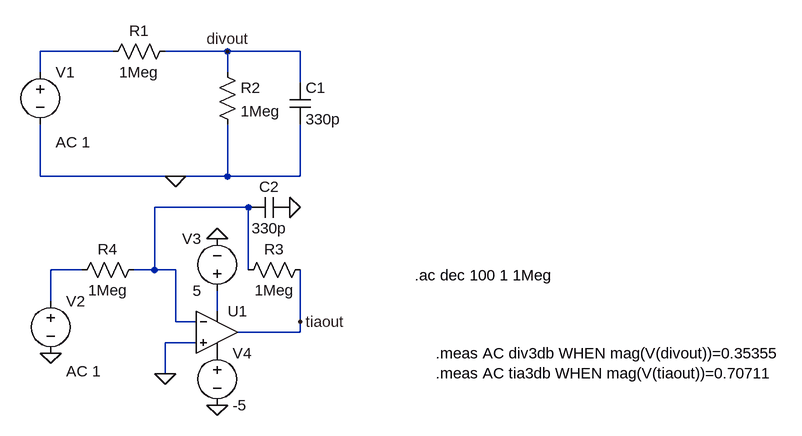
[diagram p0: schematic divider_vs_tia.asc]
divider_vs_tia.asc, the LTspice schematic file:
Version 4.1
SHEET 1 1248 768
WIRE 176 96 64 96
WIRE 352 96 256 96
WIRE 464 96 352 96
WIRE 64 128 64 96
WIRE 352 128 352 96
WIRE 464 144 464 96
WIRE 64 288 64 208
WIRE 272 288 64 288
WIRE 352 288 352 208
WIRE 352 288 272 288
WIRE 464 288 464 208
WIRE 464 288 352 288
WIRE 384 336 240 336
WIRE 128 432 80 432
WIRE 240 432 240 336
WIRE 240 432 208 432
WIRE 272 432 240 432
WIRE 384 432 384 336
WIRE 80 480 80 432
WIRE 336 496 336 464
WIRE 272 512 272 432
WIRE 304 512 272 512
WIRE 464 512 464 432
WIRE 464 528 464 512
WIRE 464 528 368 528
WIRE 304 544 256 544
WIRE 256 592 256 544
FLAG 352 96 divout
FLAG 336 640 0
FLAG 256 592 0
FLAG 336 384 0
FLAG 464 512 tiaout
FLAG 80 560 0
FLAG 272 288 0
FLAG 448 336 0
SYMBOL voltage 64 112 R0
WINDOW 123 24 124 Left 2
WINDOW 39 0 0 Left 0
SYMATTR InstName V1
SYMATTR Value ""
SYMATTR Value2 AC 1
SYMBOL res 272 80 R90
WINDOW 0 0 56 VBottom 2
WINDOW 3 32 56 VTop 2
SYMATTR InstName R1
SYMATTR Value 1Meg
SYMBOL res 336 112 R0
SYMATTR InstName R2
SYMATTR Value 1Meg
SYMBOL cap 448 144 R0
SYMATTR InstName C1
SYMATTR Value 330p
SYMBOL OpAmps\\UniversalOpAmp2 336 528 R0
SYMATTR InstName U1
SYMBOL voltage 80 464 R0
WINDOW 123 24 124 Left 2
WINDOW 39 0 0 Left 0
SYMATTR InstName V2
SYMATTR Value ""
SYMATTR Value2 AC 1
SYMBOL res 480 416 R90
WINDOW 0 0 56 VBottom 2
WINDOW 3 32 56 VTop 2
SYMATTR InstName R3
SYMATTR Value 1Meg
SYMBOL cap 448 320 R90
WINDOW 0 0 32 VBottom 2
WINDOW 3 32 32 VTop 2
SYMATTR InstName C2
SYMATTR Value 330p
SYMBOL voltage 336 480 R180
WINDOW 0 24 96 Left 2
WINDOW 3 24 16 Left 2
WINDOW 123 0 0 Left 0
WINDOW 39 0 0 Left 0
SYMATTR InstName V3
SYMATTR Value 5
SYMBOL voltage 336 544 R0
WINDOW 123 0 0 Left 0
WINDOW 39 0 0 Left 0
SYMATTR InstName V4
SYMATTR Value -5
SYMBOL res 224 416 R90
WINDOW 0 0 56 VBottom 2
WINDOW 3 32 56 VTop 2
SYMATTR InstName R4
SYMATTR Value 1Meg
TEXT 640 440 Left 2 !.ac dec 100 1 1Meg
TEXT 672 560 Left 2 !.meas AC div3db WHEN mag(V(divout))=0.35355\n.meas AC tia3db WHEN mag(V(tiaout))=0.70711

The netlist it stands for:
* divider_vs_tia.asc
V1 N001 0 AC 1
R1 divout N001 1Meg
R2 divout 0 1Meg
C1 divout 0 330p
X§U1 0 N002 N004 P001 tiaout level2 Avol=1Meg GBW=10Meg Slew=10Meg Ilimit=25m Rail=0 Vos=0 En=0 Enk=0 In=0 Ink=0 Rin=500Meg  ; pins In+ In- V+ V- OUT
V2 N003 0 AC 1
R3 tiaout N002 1Meg
C2 0 N002 330p
V3 N004 0 5
V4 P001 0 -5
R4 N002 N003 1Meg
.ac dec 100 1 1Meg
.meas AC div3db WHEN mag(V(divout))=0.35355
.meas AC tia3db WHEN mag(V(tiaout))=0.70711
.lib UniversalOpAmp2.lib
.backanno
.end